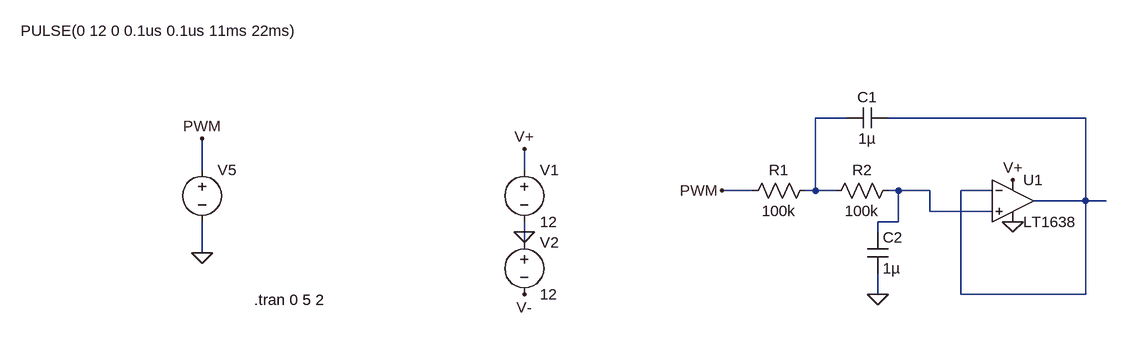
[diagram p0: schematic Sallen key.asc]
Sallen key.asc, the LTspice schematic file:
Version 4
SHEET 1 1228 680
WIRE 112 96 64 96
WIRE 480 96 176 96
WIRE -880 176 -880 128
WIRE -384 176 -384 144
WIRE -32 208 -80 208
WIRE 64 208 64 96
WIRE 64 208 48 208
WIRE 96 208 64 208
WIRE 192 208 176 208
WIRE 240 208 192 208
WIRE 336 208 288 208
WIRE 480 224 480 96
WIRE 480 224 400 224
WIRE 512 224 480 224
WIRE 240 240 240 208
WIRE 336 240 240 240
WIRE 192 256 192 208
WIRE 192 256 160 256
WIRE -384 272 -384 256
WIRE 160 272 160 256
WIRE -384 288 -384 272
WIRE -880 304 -880 256
WIRE 160 368 160 336
WIRE 288 368 288 208
WIRE 480 368 480 224
WIRE 480 368 288 368
FLAG 160 368 0
FLAG -384 144 V+
FLAG -880 304 0
FLAG -880 128 PWM
FLAG -80 208 PWM
FLAG 368 192 V+
FLAG -384 272 0
FLAG -384 368 V-
FLAG 368 256 0
SYMBOL res -48 224 R270
WINDOW 0 32 56 VTop 2
WINDOW 3 0 56 VBottom 2
SYMATTR InstName R1
SYMATTR Value 100k
SYMBOL res 80 224 R270
WINDOW 0 32 56 VTop 2
WINDOW 3 0 56 VBottom 2
SYMATTR InstName R2
SYMATTR Value 100k
SYMBOL cap 176 80 R90
WINDOW 0 0 32 VBottom 2
WINDOW 3 32 32 VTop 2
SYMATTR InstName C1
SYMATTR Value 1µ
SYMBOL cap 144 272 R0
SYMATTR InstName C2
SYMATTR Value 1µ
SYMBOL voltage -384 160 R0
WINDOW 123 0 0 Left 2
WINDOW 39 0 0 Left 2
SYMATTR InstName V1
SYMATTR Value 12
SYMBOL voltage -880 160 R0
WINDOW 3 -279 -198 Left 2
WINDOW 123 0 0 Left 2
WINDOW 39 0 0 Left 2
SYMATTR Value PULSE(0 12 0 0.1us 0.1us 11ms 22ms)
SYMATTR InstName V5
SYMBOL OpAmps\\LT1638 368 160 R0
SYMATTR InstName U1
SYMBOL voltage -384 272 R0
SYMATTR InstName V2
SYMATTR Value 12
TEXT -800 376 Left 2 !.tran 0 5 2

The netlist it stands for:
* Sallen key.asc
R1 PWM N001 100k
R2 N001 N003 100k
C1 N002 N001 1µ
C2 N003 0 1µ
V1 V+ 0 12
V5 PWM 0 PULSE(0 12 0 0.1us 0.1us 11ms 22ms)
XU1 N003 N002 V+ 0 N002 LT1638  ; pins In+ In- V+ V- OUT
V2 0 V- 12
.tran 0 5 2
.backanno
.end